# EasyEDA Pro project ProPrj_STM32音响_2025-06-08.epro, board TPA3116
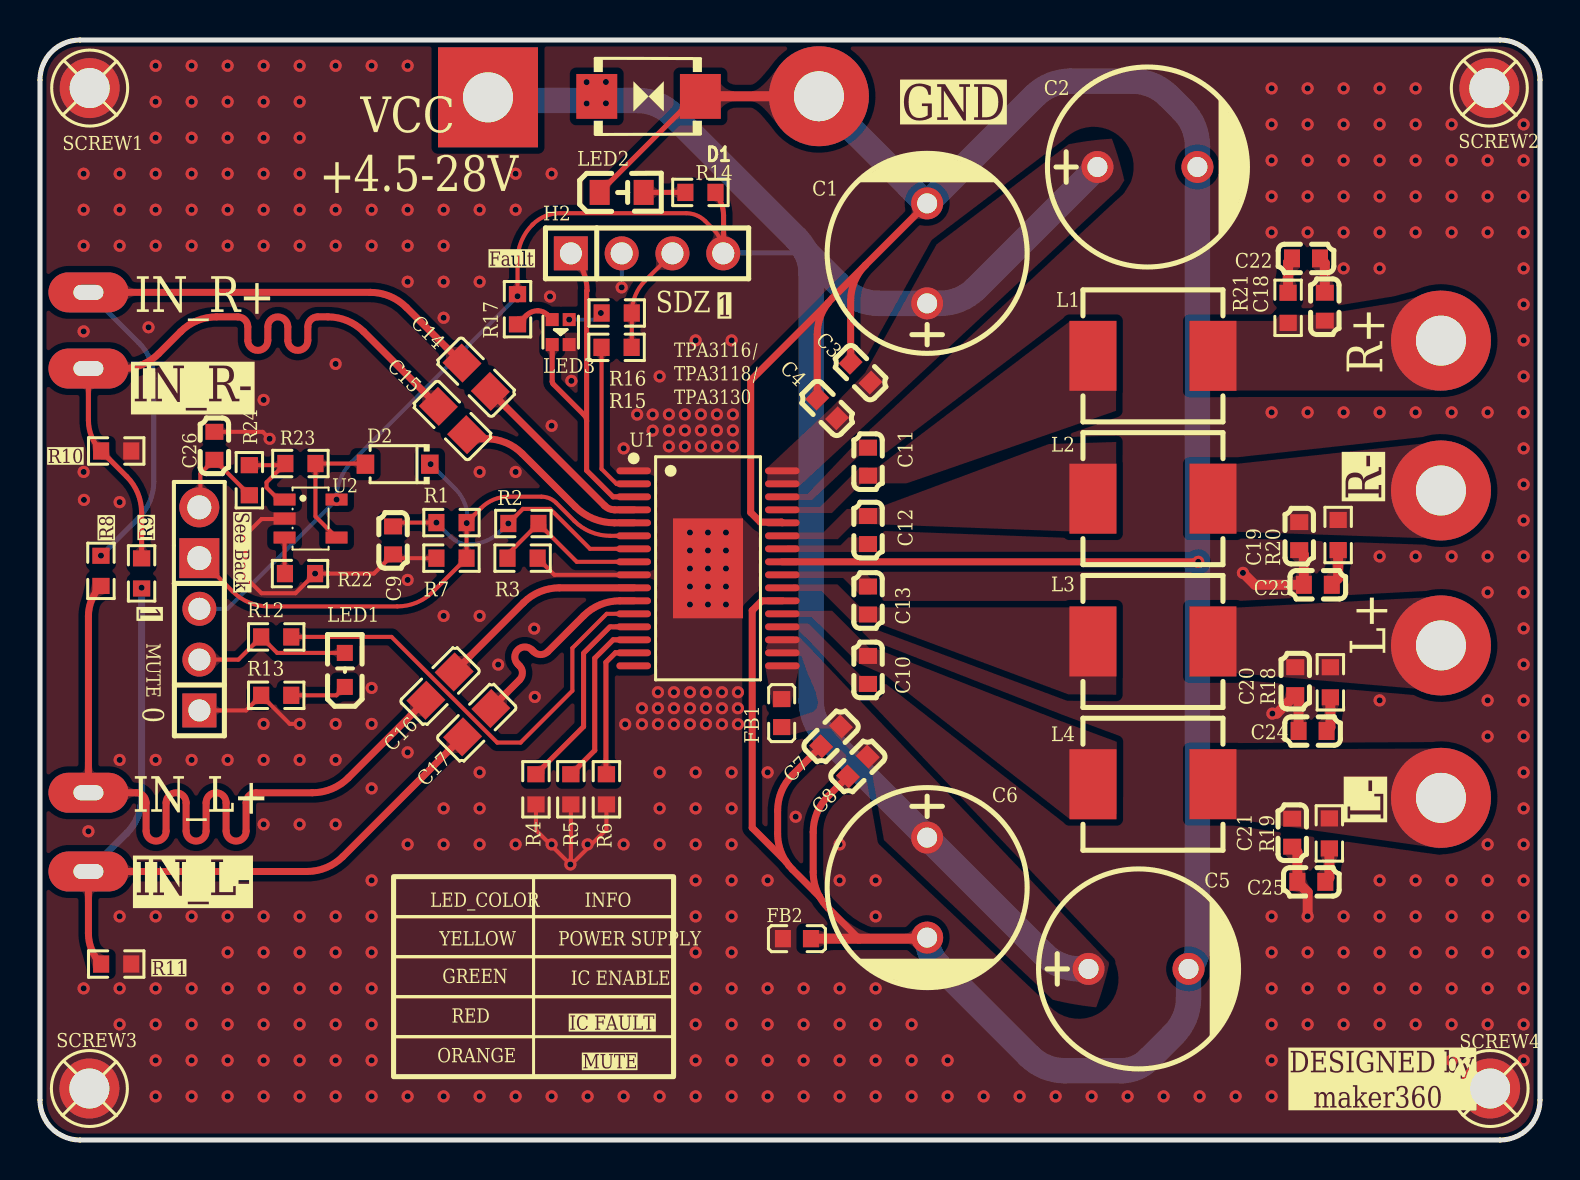
[diagram p23: board, top side]
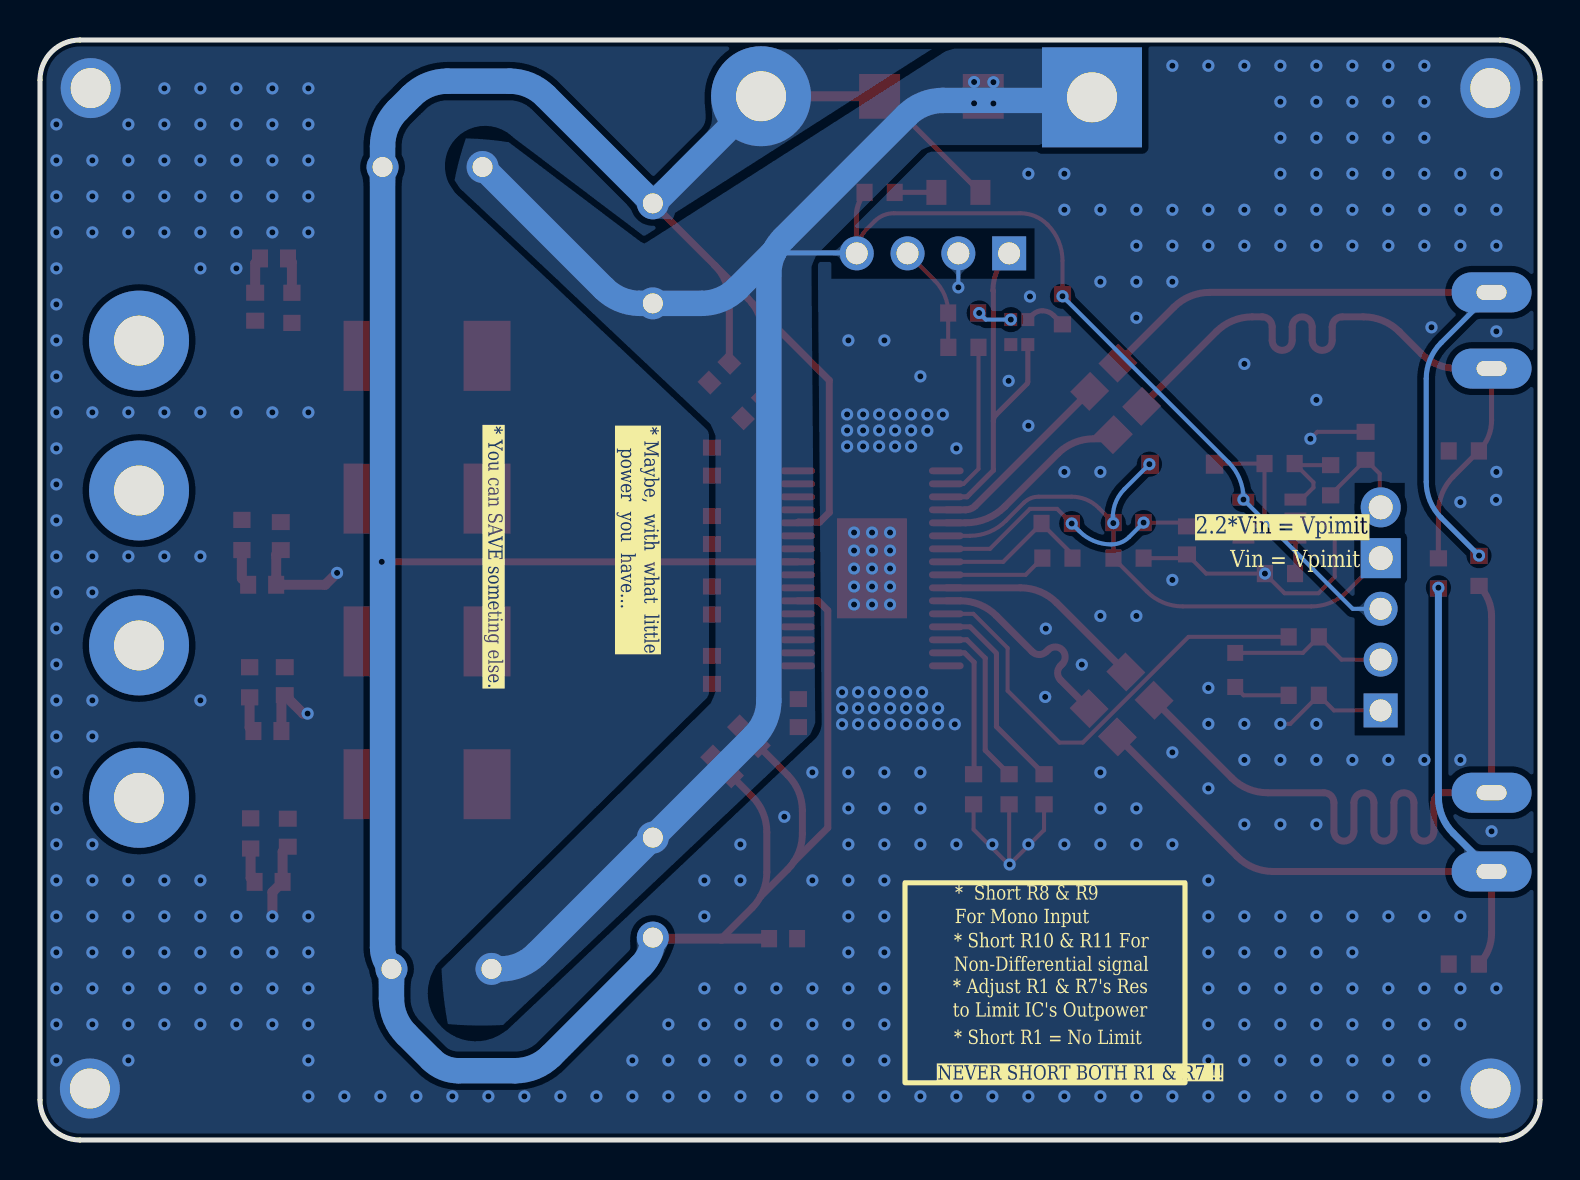
[diagram p24: board, bottom side, seen from below]

Outline 75 x 55 mm; copper layers: Top Layer, Bottom Layer. Coordinates in mm from the lower left corner of the outline.
Outline path: 0,53 0,2 arc(0.59,0.59) 2,0 73,0 arc(74.41,0.59) 75,2 75,53 arc(74.41,54.41) 73,55 2,55 arc(0.59,54.41) 0,53
Stack: Top Layer 0.035mm / Dielectric1 1.51mm FR4 er 4.5 / Bottom Layer 0.035mm

## Design rules (mm)
net RINP: DP1
net $1N2180: 123
net RINN: DP1
net $1N2218: 123
net LINP: 1233
net $1N2383: L
net LINN: 1233
net $1N2387: L
template: 自定义配置
spacing copperThickness1oz (default): track to track 0.102, other pairs 0.152 to 0.3
spacing copperThickness2oz: track to track 0.203, other pairs 0.152 to 0.3
track width copperThickness1oz (default): min 0.127, default 0.254, max 2.54
track width copperThickness2oz: min 0.203, default 0.254, max 2.54
differential pair differentialPair (default): width min 0.127, default 0.254, max 2.54; gap min 0.152, default 0.152
via viaSize (default): diameter min 0.5, default 0.61, max 10; hole min 0.3, default 0.305, max 6.3
net AGND uses copperRegion2

## Placement (name value [footprint] x y rotation side)
C1  470uF  [CAP-TH_BD10.0-P5.00-D0.6-FD-A]  44.36 44.33 90 top
C2  470uF  [CAP-TH_BD10.0-P5.00-D0.6-FD-A]  55.37 48.65 0 top
C3  100nF  [C0603]  41.03 38.37 135 top
C4  1nF  [C0603]  39.36 36.58 135 top
C5  470uF  [CAP-TH_BD10.0-P5.00-D0.6-FD-A]  54.93 8.55 0 top
C6  470uF  [CAP-TH_BD10.0-P5.00-D0.6-FD-A]  44.36 12.62 270 top
C7  100nF  [C0603]  39.55 20.18 225 top
C8  1nF  [C0603]  40.89 18.68 225 top
C9  1uF  [C0603]  17.65 29.98 90 top
C10  220nF  [C0603]  41.4 23.5 90 top
C11  220nF  [C0603]  41.4 33.92 90 top
C12  220nF  [C0603]  41.4 30.5 90 top
C13  220nF  [C0603]  41.4 26.98 90 top
C14  2.2uF  [C0805]  21.81 38.14 135 top
C15  2.2uF  [C0805]  20.62 35.98 135 top
C16  2.2uF  [C0805]  20 22.69 225 top
C17  2.2uF  [C0805]  21.84 20.87 225 top
C18  680nF  [C0603]  64.24 41.66 270 top
C19  680nF  [C0603]  62.96 30.19 270 top
C20  680nF  [C0603]  62.76 22.94 90 top
C21  680nF  [C0603]  62.61 15.37 270 top
C22  10nF  [C0603]  63.3 44.08 0 top
C23  10nF  [C0603]  63.89 27.76 180 top
C24  10nF  [C0603]  63.63 20.45 180 top
C25  10nF  [C0603]  63.57 12.91 180 top
C26  1uF  [C0603]  8.72 34.71 90 top
CN1  -  [穿孔圆焊盘 5-2.5mm#2]  70.05 39.97 0 top
CN2  -  [穿孔圆焊盘 5-2.5mm#2]  70.05 32.48 0 top
CN3  -  [穿孔圆焊盘 5-2.5mm#2]  70.05 24.73 0 top
CN4  -  [穿孔圆焊盘 5-2.5mm#2]  70.05 17.11 0 top
CN5  -  [穿孔圆焊盘 5-2.5mm]  22.4 52.13 0 top
CN6  -  [穿孔圆焊盘 5-2.5mm#2]  38.95 52.19 0 top
CN7  -  [长圆穿孔焊盘 4-2_1.5-0.75]  2.42 42.38 0 top
CN8  -  [长圆穿孔焊盘 4-2_1.5-0.75]  2.42 38.57 0 top
CN9  -  [长圆穿孔焊盘 4-2_1.5-0.75]  2.42 17.36 0 top
CN10  -  [长圆穿孔焊盘 4-2_1.5-0.75]  2.42 13.43 0 top
D1  SMBJ24CA  [SMB_L4.6-W3.6-LS5.3-BI]  30.43 52.18 180 top
D2  1N5819G-CA2-R  [SOD-123_L2.7-W1.6-LS3.7-RD-3]  17.88 33.79 180 top
FB1  FB 600Ω  [L0603]  37.08 21.35 270 top
FB2  FB 600Ω  [L0603]  37.85 10.07 180 top
H1  PZ254V-11-03P  [HDR-TH_3P-P2.54-V-M]  7.97 24.02 90 top
H2  PZ254V-11-04P  [HDR-TH_4P-P2.54-V-M]  30.35 44.33 0 top
H3  PZ254V-11-02P  [HDR-TH_2P-P2.54-V-M]  7.96 30.36 90 top
L1  10uH  [IND-SMD_L7.3-W6.8]  55.65 39.21 0 top
L2  10uH  [IND-SMD_L7.3-W6.8]  55.65 32.07 0 top
L3  10uH  [IND-SMD_L7.3-W6.8]  55.65 24.93 0 top
L4  10uH  [IND-SMD_L7.3-W6.8]  55.65 17.79 0 top
LED1  XL-1608UOC-06  [LED0603-R-RD_ORANGE]  15.24 23.5 90 top
LED2  XL-2012UYC  [LED0805-RD_YELLOW]  29.08 47.38 0 top
LED3  XL-1615SURUGC  [LED-SMD_4P-L1.6-W1.5-TL-1]  26.03 40.4 90 top
R1  0Ω  [R0603]  20.57 30.87 180 top
R2  100kΩ  [R0603]  24.17 30.82 0 top
R3  20kΩ  [R0603]  24.13 29.09 180 top
R4  10kΩ  [R0603]  24.8 17.54 90 top
R5  10kΩ  [R0603]  26.54 17.54 90 top
R6  10kΩ  [R0603]  28.32 17.54 90 top
R7  0Ω  [R0603]  20.57 29.09 0 top
R8  0Ω  [R0603]  3.05 28.46 90 top
R9  0Ω  [R0603]  5.08 28.33 90 top
R10  0Ω  [R0603]  3.81 34.45 180 top
R11  0Ω  [R0603]  3.81 8.8 180 top
R12  100kΩ  [R0603]  11.81 25.16 0 top
R13  1kΩ  [R0603]  11.81 22.23 0 top
R14  1kΩ  [R0603]  33.02 47.38 180 top
R15  100kΩ  [R0603]  28.83 39.63 180 top
R16  1kΩ  [R0603]  28.84 41.35 180 top
R17  1kΩ  [R0603]  23.88 41.54 90 top
R18  3.3Ω  [R0603]  64.52 22.89 270 top
R19  3.3Ω  [R0603]  64.47 15.33 270 top
R20  3.3Ω  [R0603]  64.91 30.25 270 top
R21  3.3Ω  [R0603]  62.41 41.61 90 top
R22  1kΩ  [R0603]  13 28.32 180 top
R23  1.2kΩ  [R0603]  13.02 33.82 0 top
R24  10kΩ  [R0603]  10.47 32.99 90 top
SCREW1  -  [M2螺丝]  2.48 52.6 0 top
SCREW2  -  [M2螺丝]  72.47 52.6 0 top
SCREW3  -  [M2螺丝]  2.47 2.57 0 top
SCREW4  -  [M2螺丝]  72.51 2.57 0 top
U1  TPA3116D2DADR  [HTSSOP-32_L11.0-W6.1-P0.65-LS8.1-BL-EP-2]  33.4 28.58 270 top
U2  LM321  [SOT-23-5_L3.0-W1.7-P0.95-LS2.8-BR]  13.53 31.07 180 top

## Footprints (pads in the part's own frame, mm; a bottom-side part is the same pattern mirrored in y, then rotated)
C0603
  rect 0.8x0.9 smd: 1(-0.7,0) 2(0.7,0)
C0805
  rect 1.41x1.35 smd: 1(-1,0) 2(1,0)
CAP-TH_BD10.0-P5.00-D0.6-FD-A
  round 1.6 hole 1: 1(-2.5,0) 2(2.5,0)
HDR-TH_2P-P2.54-V-M
  rect 2x2 hole 1.2: 1(-1.27,0)
  round 2 hole 1.2: 2(1.27,0)
HDR-TH_3P-P2.54-V-M
  rect 1.7x1.7 hole 1.1: 1(-2.54,0)
  round 1.7 hole 1.1: 2(0,0) 3(2.54,0)
HDR-TH_4P-P2.54-V-M
  rect 1.7x1.7 hole 1.1: 1(-3.81,0)
  round 1.7 hole 1.1: 2(-1.27,0) 3(1.27,0) 4(3.81,0)
HTSSOP-32_L11.0-W6.1-P0.65-LS8.1-BL-EP-2
  oval 0.343x1.732 smd: 1(-4.875,-3.716) 2(-4.225,-3.716) 3(-3.575,-3.716) 4(-2.925,-3.716) 5(-2.275,-3.716) 6(-1.625,-3.716) 7(-0.975,-3.716) 8(-0.325,-3.716) 9(0.325,-3.716) 10(0.975,-3.716) 11(1.625,-3.716) 12(2.275,-3.716) 13(2.925,-3.716) 14(3.575,-3.716) 15(4.225,-3.716) 16(4.875,-3.716) 17(4.875,3.716) 18(4.225,3.716) 19(3.575,3.716) 20(2.925,3.716) 21(2.275,3.716) 22(1.625,3.716) 23(0.975,3.716) 24(0.325,3.716) 25(-0.325,3.716) 26(-0.975,3.716) 27(-1.625,3.716) 28(-2.275,3.716) 29(-2.925,3.716) 30(-3.575,3.716) 31(-4.225,3.716) 32(-4.875,3.716)
  rect 5x3.5 smd: 33(0,0)
IND-SMD_L7.3-W6.8
  rect 2.35x3.5 smd: 1(-3,0) 2(3,0)
L0603
  rect 0.8x0.864 smd: 1(-0.7,0) 2(0.7,0)
LED0603-R-RD_ORANGE
  rect 0.8x0.8 smd: 1(0.851,0) 2(-0.851,0)
LED0805-RD_YELLOW
  rect 1x1.25 smd: 1(-1.1,0) 2(1.1,0)
LED-SMD_4P-L1.6-W1.5-TL-1
  rect 0.65x0.65 smd: 1(-0.625,0.425) 2(0.625,0.425) 3(-0.625,-0.425) 4(0.625,-0.425)
M2螺丝
  round 3 hole 2: 1(0,0)
R0603
  rect 0.806x0.864 smd: 1(-0.753,0) 2(0.753,0)
SMB_L4.6-W3.6-LS5.3-BI
  rect 2.047x2.241 smd: 1(-2.591,0) 2(2.591,0)
SOD-123_L2.7-W1.6-LS3.7-RD-3
  rect 0.88x0.96 smd: 1(-1.61,0) 2(1.61,0)
SOT-23-5_L3.0-W1.7-P0.95-LS2.8-BR
  rect 1.1x0.6 smd: 1(1.3,-0.95) 2(1.3,0) 3(1.3,0.95) 4(-1.3,0.95) 5(-1.3,-0.95)
穿孔圆焊盘 5-2.5mm
  rect 5x5 hole 2.5: 1(0,0)
穿孔圆焊盘 5-2.5mm#2
  round 5 hole 2.5: 1(0,0)
长圆穿孔焊盘 4-2_1.5-0.75
  oval 4x2 hole 1.5x0.75: 1(0,0)

## Nets
As in the schematic, except:
AGND: C9.1 C18.1 C19.2 C20.1 C21.2 C22.2 C23.2 C24.2 C25.2 C26.2 FB2.2 H1.1 H2.2 LED3.3 R3.1 R4.1 R5.1 R6.1 R7.1 R10.1 R11.1 R13.1 R22.1 SCREW1.1 SCREW2.1 SCREW3.1 SCREW4.1 U1.1 U1.9 U1.33 U2.2

Pads without a net: U1 16

## Via types
v1: diameter 0.61, hole 0.305, Top Layer to Bottom Layer, 404 vias

## Routing (per net, layer and track width the routed paths; a pad name or vN(x,y) marks a point on that pad's centre or on a via; arc(x,y) is an arc through that point)
AGND: length 55.5
  Top Layer w0.203: R7.1 17.84,29.09 C9.1 16.69,28.32 v1(13.75,28.32) 12.77,27.34 11.07,27.34 10.26,28.15 10.26,30.24 11.07,31.05 12.2,31.05 U2.2 ; 26.54,13.75 v1(26.52,13.78) 24.8,15.5 R4.1 ; 26.54,13.75 28.32,15.53 R6.1 ; 26.54,13.75 R5.1 ; H1.1 10.3,21.48 R13.1 12.49,20.8 v1(12.98,20.8) ; R3.1 25.72,28.26 29.68,28.26 ; C26.2 11.13,35.41 v1(11.48,35.06)
  Top Layer w0.5: 62.96,29.49 63.19,29.26 C23.2 60.74,27.76 v1(60.15,28.36) ; v1(63.38,11.18) 63.38,12.39 C25.2 62.87,14.41 C21.2 ; 64.24,42.36 64.24,43.84 C22.2 ; C24.2 62.93,22.07 C20.1 61.84,21.32 v1(61.62,21.32)
  Bottom Layer w0.203: H2.2 v1(29.08,42.63)
  vias: v1(2.18,48.31) v1(2.18,46.51) v1(2.18,44.71) v1(2.18,40.43) v1(2.18,33.4) v1(2.2,32.01) v1(2.18,7.58) v1(2.42,15.44) v1(3.98,48.31) v1(3.98,46.51) v1(3.98,44.71) v1(3.98,31.89) v1(3.98,19) v1(3.98,11.18) v1(3.98,7.58) v1(3.98,5.78) v1(5.43,40.63) v1(5.78,53.71) v1(5.78,51.91) v1(5.78,50.11) v1(5.78,48.31) v1(5.78,46.51) v1(5.78,44.71) v1(5.78,19) v1(5.78,11.18) v1(5.78,7.58) v1(5.78,5.78) v1(5.78,3.98) v1(5.78,2.18) v1(7.58,53.71) v1(7.58,51.91) v1(7.58,50.11) v1(7.58,48.31) v1(7.58,46.51) v1(7.58,44.71) v1(7.58,19) v1(7.58,11.18) v1(7.58,7.58) v1(7.58,5.78) v1(7.58,3.98) v1(7.58,2.18) v1(9.38,53.71) v1(9.38,51.91) v1(9.38,50.11) v1(9.38,48.31) v1(9.38,46.51) v1(9.38,44.71) v1(9.38,19) v1(9.38,11.18) v1(9.38,9.38) v1(9.38,7.58) v1(9.38,5.78) v1(9.38,3.98) v1(9.38,2.18) v1(11.18,53.71) v1(11.18,51.91) v1(11.18,50.11) v1(11.18,48.31) v1(11.18,46.51) v1(11.18,44.71) v1(11.18,37) v1(11.18,20.8) v1(11.18,19) v1(11.18,15.78) v1(11.18,11.18) v1(11.18,9.38) v1(11.18,7.58) v1(11.18,5.78) v1(11.18,3.98) v1(11.18,2.18) v1(12.98,53.71) v1(12.98,51.91) v1(12.98,50.11) v1(12.98,48.31) v1(12.98,46.51) v1(12.98,44.71) v1(12.98,19) v1(12.98,15.78) v1(12.98,11.18) v1(12.98,9.38) v1(12.98,7.58) v1(12.98,5.78) v1(12.98,3.98) v1(12.98,2.18) v1(14.78,53.71) v1(14.78,46.51) v1(14.78,44.71) v1(14.78,38.8) v1(14.78,20.8) v1(14.78,19) v1(14.78,15.78) v1(14.78,11.18) v1(14.78,9.38) v1(14.78,7.58) v1(14.78,5.78) v1(14.78,3.98) v1(14.78,2.18) v1(16.58,53.71) v1(16.58,46.51) v1(16.58,44.71) v1(16.58,22.6) v1(16.58,20.8) v1(16.58,17.58) v1(16.58,12.98) v1(16.58,11.18) v1(16.58,9.38) v1(16.58,7.58) v1(16.58,5.78) v1(16.58,3.98) v1(16.58,2.18) v1(18.38,53.71) v1(18.38,46.51) v1(18.38,44.71) v1(18.38,42.91) v1(18.38,28) v1(18.38,19.38) v1(18.38,14.78) v1(18.38,2.18) v1(20.18,46.51) v1(20.18,44.71) v1(20.18,42.91) v1(20.18,41.11) v1(20.18,26.2) v1(20.18,16.58) v1(20.18,14.78) v1(20.18,2.18) v1(21.98,46.51) v1(21.98,42.91) v1(21.98,33.4) v1(21.98,26.2) v1(21.98,18.38) v1(21.98,16.58) v1(21.98,14.78) v1(21.98,2.18) v1(22.91,23.77) v1(23.78,48.31) v1(23.78,46.51) v1(23.78,33.4) v1(23.78,14.78) v1(23.78,2.18) v1(24.71,25.57) v1(24.74,22.16) v1(25.5,42.17) v1(25.58,48.31) v1(25.58,35.71) v1(25.58,14.78) v1(25.58,2.18) v1(26.57,37.96) v1(27.38,14.78) v1(27.38,2.18) v1(29.18,34.58) v1(29.26,20.79) v1(29.18,14.78) v1(29.18,2.18) v1(29.86,36.28) v1(30.1,21.59) v1(30.1,20.79) v1(30.63,36.28) v1(30.63,35.47) v1(30.9,22.39) v1(30.9,21.59) v1(30.9,20.79) v1(30.98,38.18) v1(30.98,18.38) v1(30.98,16.58) v1(30.98,14.78) v1(30.98,2.18) v1(31.44,36.28) v1(31.44,35.48) v1(31.44,34.68) v1(31.7,22.39) v1(31.7,21.59) v1(31.7,20.79) v1(32.25,36.28) v1(32.25,35.48) v1(32.25,34.68) v1(32.5,30.37) v1(32.5,29.47) v1(32.5,28.57) v1(32.5,27.67) v1(32.5,26.77) v1(32.5,22.39) v1(32.5,21.59) v1(32.5,20.79) v1(32.78,39.98) v1(32.78,18.38) v1(32.78,16.58) v1(32.78,14.78) v1(32.78,12.98) v1(32.78,11.18) v1(32.78,9.38) v1(32.78,7.58) v1(32.78,5.78) v1(32.78,3.98) v1(32.78,2.18) v1(33.04,36.28) v1(33.04,35.48) v1(33.04,34.68) v1(33.3,22.39) v1(33.3,21.59) v1(33.3,20.79) v1(33.4,30.37) v1(33.4,29.47) v1(33.4,28.57) v1(33.4,27.67) v1(33.4,26.77) v1(33.84,36.28) v1(33.84,35.48) v1(33.84,34.68) v1(34.1,22.39) v1(34.1,21.59) v1(34.1,20.79) v1(34.3,30.37) v1(34.3,29.47) v1(34.3,28.57) v1(34.3,27.67) v1(34.3,26.77) v1(34.58,39.98) v1(34.64,36.28) v1(34.64,35.48) v1(34.64,34.68) v1(34.58,18.38) v1(34.58,16.58) v1(34.58,14.78) v1(34.58,12.98) v1(34.58,11.18) v1(34.58,9.38) v1(34.58,7.58) v1(34.58,5.78) v1(34.58,3.98) v1(34.58,2.18) v1(34.9,22.39) v1(34.9,21.59) v1(34.9,20.79) v1(36.38,18.38) v1(36.38,12.98) v1(36.38,7.58) v1(36.38,5.78) v1(36.38,3.98) v1(36.38,2.18) v1(37.78,16.16) v1(38.18,7.58) v1(38.18,5.78) v1(38.18,3.98) v1(38.18,2.18) v1(39.98,14.78) v1(39.98,12.98) v1(39.98,7.58) v1(39.98,5.78) v1(39.98,3.98) v1(39.98,2.18) v1(41.78,12.98) v1(41.78,11.18) v1(41.78,7.58) v1(41.78,5.78) v1(41.78,3.98) v1(41.78,2.18) v1(43.58,5.78) v1(43.58,3.98) v1(43.58,2.18) v1(45.38,3.98) v1(45.38,2.18) v1(47.18,2.18) v1(48.98,2.18) v1(50.78,2.18) v1(52.58,2.18) v1(54.38,2.18) v1(56.18,2.18) v1(57.98,2.18) v1(59.78,2.18) v1(61.58,52.58) v1(61.58,50.78) v1(61.58,48.98) v1(61.58,47.18) v1(61.58,45.38) v1(61.58,36.38) v1(61.58,11.18) v1(61.58,9.38) v1(61.58,7.58) v1(61.58,5.78) v1(61.58,3.98) v1(61.58,2.18) v1(63.38,52.58) v1(63.38,50.78) v1(63.38,48.98) v1(63.38,47.18) v1(63.38,45.38) v1(63.38,36.38) v1(63.38,9.38) v1(63.38,7.58) v1(63.38,5.78) v1(65.18,52.58) v1(65.18,50.78) v1(65.18,48.98) v1(65.18,47.18) v1(65.18,45.38) v1(65.18,43.58) v1(65.18,36.38) v1(65.18,11.18) v1(65.18,9.38) v1(65.18,7.58) v1(65.18,5.78) v1(66.98,52.58) v1(66.98,50.78) v1(66.98,48.98) v1(66.98,47.18) v1(66.98,45.38) v1(66.98,43.58) v1(66.98,36.38) v1(66.98,29.18) v1(66.98,21.98) v1(66.98,12.98) v1(66.98,11.18) v1(66.98,9.38) v1(66.98,7.58) v1(66.98,5.78) v1(68.78,52.58) v1(68.78,50.78) v1(68.78,48.98) v1(68.78,47.18) v1(68.78,45.38) v1(68.78,36.38) v1(68.78,29.18) v1(68.78,12.98) v1(68.78,11.18) v1(68.78,9.38) v1(68.78,7.58) v1(68.78,5.78) v1(70.58,50.78) v1(70.58,48.98) v1(70.58,47.18) v1(70.58,45.38) v1(70.58,36.38) v1(70.58,29.18) v1(70.58,12.98) v1(70.58,11.18) v1(70.58,9.38) v1(70.58,7.58) v1(70.58,5.78) v1(70.58,3.98) v1(72.38,48.98) v1(72.38,47.18) v1(72.38,45.38) v1(72.38,36.38) v1(72.38,29.18) v1(72.38,27.38) v1(72.38,21.98) v1(72.38,20.18) v1(72.38,14.78) v1(72.38,12.98) v1(72.38,11.18) v1(72.38,9.38) v1(72.38,7.58) v1(72.38,5.78) v1(74.18,50.78) v1(74.18,48.98) v1(74.18,47.18) v1(74.18,45.38) v1(74.18,43.58) v1(74.18,41.78) v1(74.18,39.98) v1(74.18,38.18) v1(74.18,36.38) v1(74.18,34.58) v1(74.18,32.78) v1(74.18,30.98) v1(74.18,29.18) v1(74.18,27.38) v1(74.18,25.58) v1(74.18,23.78) v1(74.18,21.98) v1(74.18,20.18) v1(74.18,18.38) v1(74.18,16.58) v1(74.18,14.78) v1(74.18,12.98) v1(74.18,11.18) v1(74.18,9.38) v1(74.18,7.58) v1(74.18,5.78) v1(74.18,3.98)
PGND: length 190.1
  Top Layer w0.254: LED2.1 32.79,52.19
  Top Layer w0.35: U1.25 v1(57.91,28.91) ; 37.3,13.92 35.61,15.61 35.61,26.48 36.09,26.96 U1.22 ; 37.3,13.92 arc(37.37,13.82) 37.44,13.73 arc(37.53,13.62) 37.62,13.52 38.98,12.17 ; 37.3,13.92 arc(36.99,14.59) 36.88,15.32 36.88,16.47 arc(37.07,17.43) 37.62,18.25 39.06,19.69 ; 40.94,10.07 39.4,11.6 arc(39.17,11.87) 38.98,12.17 ; 38.98,12.17 arc(38.74,12.76) 38.66,13.4 38.66,15.39 arc(38.85,16.36) 39.4,17.19 40.4,18.18 ; C4.2 38.86,40.28 arc(39,41.11) 39.4,41.85 ; 41.28,43.75 39.61,42.08 arc(39.5,41.97) 39.4,41.85 ; 41.28,43.75 C1.2 ; 41.28,43.75 arc(40.73,42.93) 40.53,41.95 C3.2 ; 39.4,41.85 35.53,37.98 35.53,31.38 36.02,30.9 37.08,30.9 U1.28
  Top Layer w0.5: 32.79,52.19 CN6.1 ; FB2.1 44.31,10.07 C6.2
  Bottom Layer w1.27: CN6.1 44.26,46.87 arc(44.31,46.84) C1.2 49.72,52.2 arc(50.55,52.75) 51.52,52.94 54.62,52.94 arc(55.6,52.75) 56.42,52.2 57.13,51.49 arc(57.68,50.67) 57.87,49.7 C2.2 57.87,9.63 arc(57.76,9.05) C5.2 57.43,7.08 arc(57.23,6.11) 56.68,5.28 55.42,4.02 arc(54.8,3.61) 54.07,3.46 51.24,3.46 arc(50.27,3.66) 49.45,4.21 44.94,8.71 arc(44.51,9.36) C6.2
VCC: length 124.1
  Top Layer w0.203: R17.2 23.88,43.97 arc(24.07,44.94) 24.62,45.76 24.64,45.78 arc(25.26,46.19) 25.99,46.34 32.31,46.34 arc(32.83,46.24) 33.26,45.94 33.66,45.55 arc(34.03,44.99) 34.16,44.33
  Top Layer w0.254: 34.18,44.34 34.18,46.23 arc(34.06,46.85) 33.71,47.36
  Bottom Layer w0.203: v1(23.88,42.19) 15.57,33.88 arc(15.02,33.06) 14.83,32.09 v1(14.83,32.02) 9.37,26.56 H1.3
  Bottom Layer w0.254: 38.29,44.42 38.22,44.36 34.23,44.36
  Bottom Layer w1.27: 22.5,51.98 29.86,51.98 arc(30.83,51.78) 31.66,51.23 37.81,45.08 arc(38.08,44.77) 38.29,44.42 ; 38.29,44.42 40.13,42.58 arc(40.96,42.03) 41.93,41.83 C1.1 45,41.83 arc(45.97,42.03) 46.8,42.58 C2.1 ; 38.29,44.42 arc(38.49,43.87) 38.56,43.28 38.56,21.97 arc(38.75,21) 39.3,20.18 C6.1 50.18,9.3 arc(51,8.75) 51.98,8.55 C5.1
  vias: v1(27.33,52.89) v1(27.33,51.83) v1(28.3,52.9) v1(28.3,51.83)
FAULTZ: length 18.5
  Top Layer w0.254: 27.33,35.95 27.33,33.48 28.65,32.16 29.68,32.16 ; 27.33,35.95 27.33,42.45 27.35,42.47 arc(27.16,43.44) 26.61,44.27 H2.1 ; 27.33,35.95 arc(27.3,36.11) 27.2,36.26 25.65,37.8 arc(25.62,37.85) 25.61,37.91 LED3.1
LINN: length 41.2
  Top Layer w0.35: 21.13,20.16 15.14,14.17 arc(14.32,13.62) 13.34,13.43 CN10.1 2.42,10.33 arc(2.59,9.5) R11.2
  Bottom Layer w0.35: 5.08,27.44 5.08,17.14 arc(4.89,16.16) 4.34,15.34 CN10.1
  vias: v1(5.08,27.62)
LINP: length 41.1
  Top Layer w0.35: C16.2 15.41,18.11 arc(14.59,17.56) 13.62,17.36 10.8,17.36 arc(10.45,17.22) 10.3,16.86 10.3,15.44 arc(9.8,14.94) 9.3,15.44 9.3,16.86 arc(8.8,17.36) 8.3,16.86 8.3,15.44 arc(7.8,14.94) 7.3,15.44 7.3,16.86 arc(6.8,17.36) 6.3,16.86 6.3,15.44 arc(5.8,14.94) 5.3,15.44 5.3,16.86 arc(5.16,17.22) 4.8,17.36 CN9.1 2.42,26.19 arc(2.58,27.01) R8.1
MUTE: length 23.2
  Top Layer w0.203: 29.68,26.31 28.33,26.31 26.62,24.6 26.62,22.46 24.03,19.87 22.86,19.87 17.58,25.16 R12.2
PLIMIT: length 30
  Top Layer w0.203: H3.1 9.63,27.42 arc(10.46,26.87) 11.43,26.68 17.86,26.68 arc(18.83,26.87) 19.66,27.42 R7.2 R1.1 22.06,31.6 arc(22.68,32.02) 23.42,32.17 25.07,32.17 arc(25.47,32.09) 25.81,31.86 26.71,30.95 arc(27.54,30.4) 28.51,30.21 29.69,30.21
  Bottom Layer w0.203: v1(19.53,33.79) 20.78,32.54 arc(21.26,31.76) v1(21.34,30.84)
RINN: length 35.5
  Top Layer w0.254: CN8.1 2.42,35.99 arc(2.59,35.16) R10.2 4.34,33.17 arc(4.89,32.35) 5.08,31.38 R9.2
  Top Layer w0.35: C15.2 16.19,40.41 arc(15.36,40.96) 14.39,41.16 13.89,41.16 arc(13.54,41.01) 13.39,40.66 13.39,39.98 arc(12.89,39.48) 12.39,39.98 12.39,40.66 arc(11.89,41.16) 11.39,40.66 11.39,39.98 arc(10.89,39.48) 10.39,39.98 10.39,40.66 arc(10.24,41.01) 9.89,41.16 8.82,41.16 arc(7.85,40.96) 7.03,40.41 5.93,39.32 arc(5.11,38.76) 4.13,38.57 CN8.1
RINP: length 35.4
  Top Layer w0.35: CN7.1 16.51,42.38 arc(17.49,42.19) 18.31,41.64 21.1,38.85
  Bottom Layer w0.254: CN7.1 4.95,39.86 arc(5.5,39.03) 5.69,38.06 5.69,32.91 arc(5.5,31.94) 4.95,31.12 v1(3.05,29.22)
SDZ: length 8
  Top Layer w0.203: 29.69,32.81 28.82,32.81 28.08,33.55 R15.2
$1N1192: length 14
  Top Layer w0.203: v1(23.42,30.82) 24.15,31.56 25.5,31.56 27.5,29.56 29.68,29.56 ; C9.2 17.84,30.87 v1(19.82,30.87)
  Bottom Layer w0.203: v1(19.82,30.87) 20.54,30.15 arc(20.95,29.87) 21.44,29.78 arc(22.3,29.95) 23.03,30.44 v1(23.42,30.82)
$1N1197: length 7.9
  Top Layer w0.203: R3.2 23.38,29.28 R2.2 26.84,28.91 29.68,28.91
$1N1486: length 10
  Top Layer w0.254: 29.68,25.66 28.55,25.66 ; R4.2 27.18,20.67 27.18,24.29 ; 28.49,25.66 27.18,24.34
$1N1491: length 8.6
  Top Layer w0.254: R5.2 27.74,19.48 27.74,24.09 28.66,25.01 29.68,25.01
$1N1497: length 7.2
  Top Layer w0.254: R6.2 28.3,18.31 28.3,23.89 28.77,24.36 29.68,24.36
$1N2180: length 9.6
  Top Layer w0.35: 29.68,31.51 28.72,31.51 arc(28.46,31.56) 28.24,31.71 22.51,37.43
$1N2218: length 9.5
  Top Layer w0.35: 21.69,35.06 22.32,35.06 arc(23.29,34.87) 24.11,34.32 26.76,31.67 arc(27.66,31.07) 28.72,30.86 29.68,30.86
$1N2383: length 10.6
  Top Layer w0.35: 29.68,27.61 25.97,27.61 arc(25,27.42) 24.17,26.87 C16.1
$1N2387: length 10.6
  Top Layer w0.35: 29.68,26.96 28.98,26.96 arc(28.01,26.77) 27.19,26.22 25.39,24.42 arc(25.04,24.27) 24.68,24.42 24.59,24.51 arc(23.89,24.51) 23.89,23.8 23.97,23.71 arc(24.12,23.36) 23.97,23 22.54,21.57
$1N4731: length 8.1
  Top Layer w0.203: LED1.1 11.86,24.36 R12.1 9.92,24.02 H1.2
$1N4980: length 2.8
  Top Layer w0.203: LED1.2 14.82,22.23 R13.2
$1N5308: length 2.1
  Top Layer w0.254: LED2.2 R14.2
$1N5465: length 5.4
  Top Layer w0.203: 31.62,44.33 30.26,42.97 arc(29.77,42.23) R16.1 29.59,39.65 arc(29.59,39.64) R15.1
$1N5534: length 1.7
  Bottom Layer w0.2: v1(26.46,41.02) 27.71,41.02 v1(28.04,41.35)
$1N5603: length 2.1
  Top Layer w0.254: LED3.2 25.36,41.27 arc(25.15,41.41) 24.89,41.46 arc(24.58,41.4) 24.31,41.22 R17.1
$1N5880: length 1.8
  Top Layer w0.5: C22.1 62.41,43.88 R21.2
$1N5916: length 1.9
  Top Layer w0.5: C23.1 64.91,28.08 R20.2
$1N5952: length 1.8
  Top Layer w0.5: C24.1 64.52,20.64 R18.2
$1N5988: length 1.8
  Top Layer w0.5: R19.2 64.47,13.11 C25.1
$1N8191: length 1.8
  Top Layer w0.203: R22.2 12.23,28.34 12.23,30.12
$1N14597: length 4.9
  Top Layer w0.203: 8.73,34.03 8.02,33.32 8.02,31.9 ; R24.1 10.47,32.26 C26.1
$1N14607: length 4.5
  Top Layer w0.203: 10.47,33.74 12.19,33.74 ; 12.19,33.74 11.33,32.88 11.33,32.62 11.93,32.02 U2.1 ; 12.19,33.74 R23.1
$1N18771: length 6.6
  Top Layer w0.203: 14.83,30.12 13.77,31.18 R23.2 16.19,33.82 arc(16.24,33.81) D2.2

## Copper pours and planes (outline as drawn; the poured copper is in the pictures)
AGND on Top Layer: -0.05,55.28 75.95,55.28 75.95,-0.6 -0.05,-0.6
AGND on Bottom Layer: -1.27,56.3 78.13,56.3 78.13,-0.91 -1.27,-0.91
PGND on Bottom Layer: 30.4,54.55 44.28,54.55 44.28,46.02 30.4,46.02
VCC on Top Layer: 36.29,25.18 53.44,25.18 53.44,6.63 36.29,6.63
VCC on Top Layer: 36.36,50.06 54.22,50.06 54.22,32.65 36.36,32.65
VCC on Bottom Layer: 21.28,54.57 54.93,54.57 54.93,5.72 21.28,5.72
$1N931 on Top Layer: 36.25,23.73 37.98,23.73 37.98,21.63 36.25,21.63
$1N1764 on Top Layer: 37.62,26.46 41.77,26.46 41.77,23.81 37.62,23.81
$1N1764 on Top Layer: 40.95,24.54 53.84,24.54 53.84,16.04 40.95,16.04
$1N1768 on Top Layer: 37.57,25.82 41.11,25.82 41.11,22.41 37.57,22.41
$1N1917 on Top Layer: 37.31,35.02 41.35,35.02 41.35,32.01 37.31,32.01
$1N1948 on Top Layer: 41.4,34.9 53.81,34.9 53.81,30.34 41.4,30.34
$1N1948 on Top Layer: 37.32,31.55 41.55,31.55 41.55,30.04 37.32,30.04
$1N1956 on Top Layer: 37.31,30.13 41.08,30.13 41.08,29.4 37.31,29.4
$1N1964 on Top Layer: 37.26,28.42 41.6,28.42 41.6,27.28 37.26,27.28
$1N1970 on Top Layer: 37.64,27.78 41.05,27.78 41.05,25.9 37.64,25.9
$1N1970 on Top Layer: 41.4,26.63 53.81,26.63 53.81,22.26 41.4,22.26
$1N2035 on Top Layer: 41.59,40.94 53.81,40.94 53.81,32.83 41.59,32.83
$1N2035 on Top Layer: 37.74,33.62 41.4,33.62 41.4,31.34 37.74,31.34
$1N2892 on Top Layer: 58.72,42.48 70.05,42.48 70.05,37.48 58.72,37.48
$1N2900 on Top Layer: 59.38,34.92 70.05,34.92 70.05,30.07 59.38,30.07
$1N2902 on Top Layer: 59.56,27.18 70.12,27.18 70.12,22.45 59.56,22.45
$1N2906 on Top Layer: 59.77,19.58 69.98,19.58 69.98,14.58 59.77,14.58

Small or netless copper shapes (teardrops, artwork), in the pictures only: 145 on Top Layer, 31 on Bottom Layer

## Text on the board
Bottom Silkscreen Layer: *  Short R8 & R9 / For Mono Input | * Short R10 & R11 For / Non-Differential signal | * Short R1 = No Limit | * Adjust R1 & R7's Res / to Limit IC's Outpower | NEVER SHORT BOTH R1 & R7 !! | * Maybe,  with  what  little / power  you  have... | * You can SAVE someting else. | Vin = Vpimit | 2.2*Vin = Vpimit
Top Silkscreen Layer: LED_COLOR | ORANGE | YELLOW | GREEN | RED | Fault | POWER SUPPLY | IC FAULT | IC ENABLE | MUTE | INFO | TPA3116/ / TPA3118/ / TPA3130 | See Back | SDZ | 1 | DESIGNED by / maker360 | 0 | IN_R- | IN_L+ | IN_R+ | IN_L- | VCC / +4.5-28V | GND | R- | R+ | L- | L+
